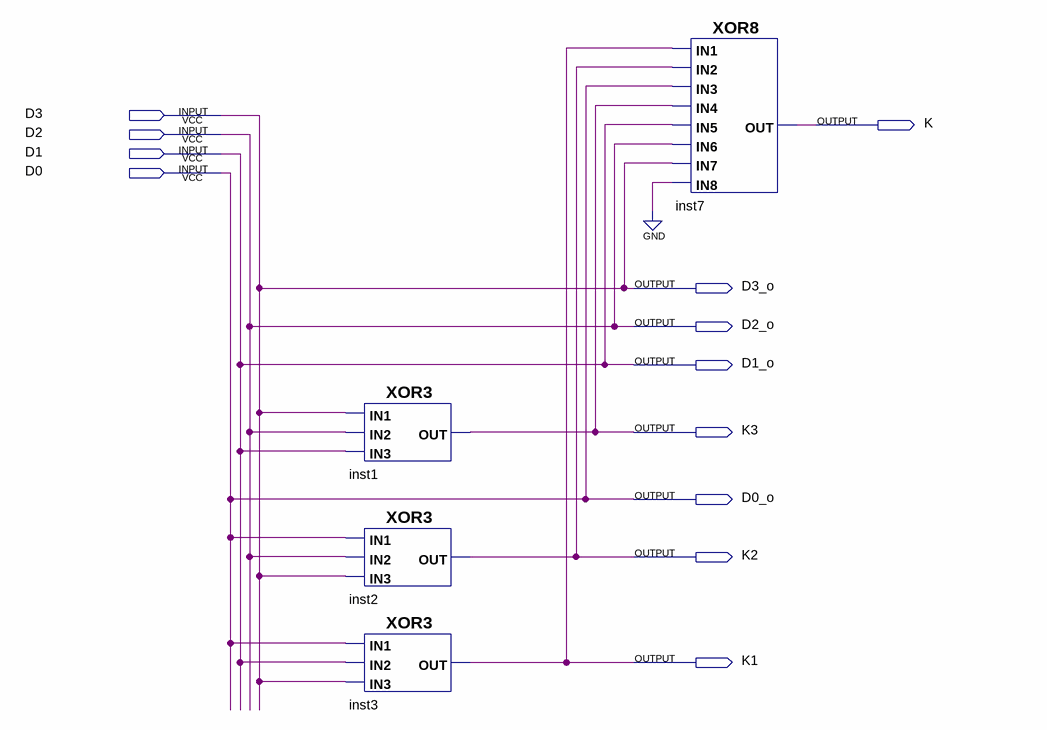
[diagram p0: schematic sheet]
// Quartus schematic CD_g.bdf as structural Verilog: 4 symbols, 12 pins
module CD_g (
  input  D3,
  input  D2,
  input  D1,
  input  D0,
  output K,
  output D3_o,
  output D2_o,
  output D1_o,
  output K3,
  output D0_o,
  output K2,
  output K1
);

  XOR3 inst1 (.IN3(D1), .IN1(D3), .IN2(D2), .OUT(K3));
  XOR3 inst2 (.IN3(D3), .IN1(D0), .IN2(D2), .OUT(K2));
  XOR3 inst3 (.IN3(D3), .IN1(D0), .IN2(D1), .OUT(K1));
  XOR8 inst7 (.IN8(1'b0), .IN1(K1), .IN7(D3), .IN6(D2), .IN5(D1), .IN4(K3), .IN3(D0), .IN2(K2), .OUT(K));

  assign D0_o = D0;
  assign D1_o = D1;
  assign D2_o = D2;
  assign D3_o = D3;
endmodule
